# Altium project HeartSoundClone.PrjPcb
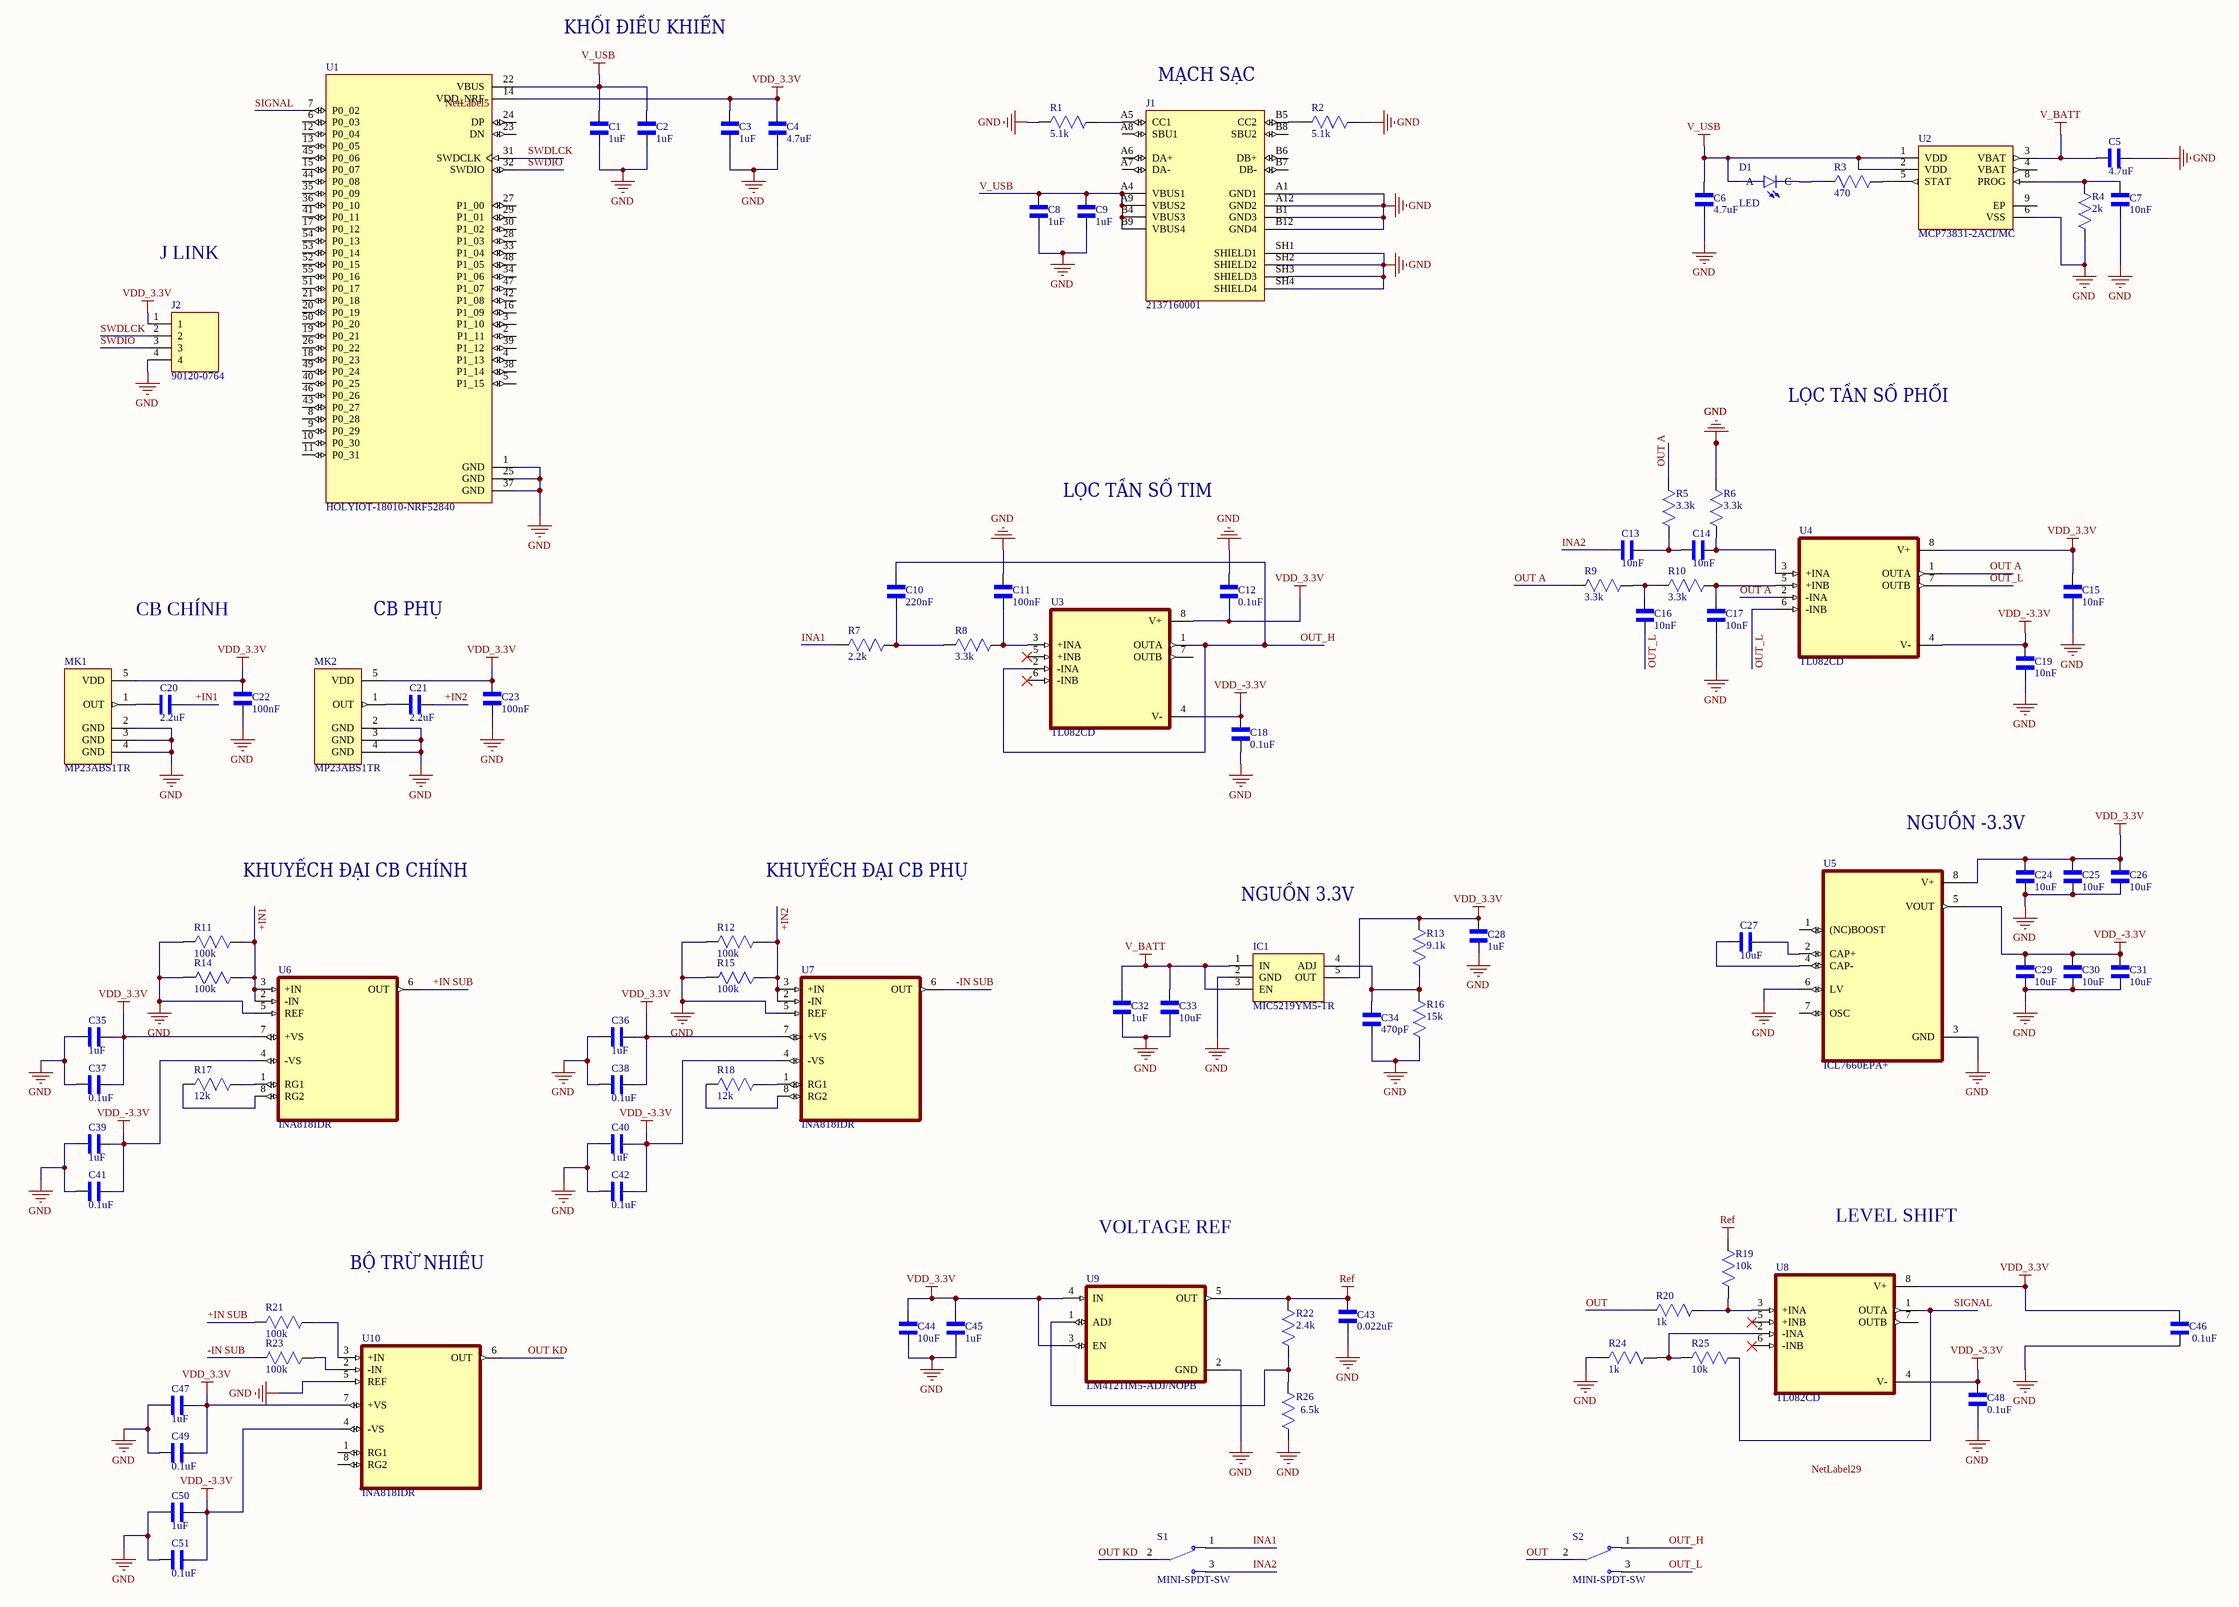
[diagram p0: Sheet2.SchDoc]
1 sheet, 95 parts. Net scope: global (net labels, ports and power ports of the same name join across sheets).
Board file: PCB1.PcbDoc

## Sheet Sheet2.SchDoc
size C; SheetNumber: 1; SheetTotal: 1

### Parts
C1  1uF  [CAPC1608X90N]
C2  1uF  [CAPC1608X90N]
C3  1uF  [CAPC1608X90N]
C4  4.7uF  [CAPC1608X90N]
C5  4.7uF  [CAPC1608X90N]
C6  4.7uF  [CAPC1608X90N]
C7  10nF  [CAPC1608X90N]
C8  1uF  [CAPC1608X90N]
C9  1uF  [CAPC1608X90N]
C10  220nF  [CAPC1608X90N]
C11  100nF  [CAPC1608X90N]
C12  0.1uF  [CAPC1608X90N]
C13  10nF  [CAPC1608X90N]
C14  10nF  [CAPC1608X90N]
C15  10nF  [CAPC1608X90N]
C16  10nF  [CAPC1608X90N]
C17  10nF  [CAPC1608X90N]
C18  0.1uF  [CAPC1608X90N]
C19  10nF  [CAPC1608X90N]
C20  2.2uF  [CAPC1608X90N]
C21  2.2uF  [CAPC1608X90N]
C22  100nF  [CAPC1608X90N]
C23  100nF  [CAPC1608X90N]
C24  10uF  [CAPC1608X90N]
C25  10uF  [CAPC1608X90N]
C26  10uF  [CAPC1608X90N]
C27  10uF  [CAPC1608X90N]
C28  1uF  [CAPC1608X90N]
C29  10uF  [CAPC1608X90N]
C30  10uF  [CAPC1608X90N]
C31  10uF  [CAPC1608X90N]
C32  1uF  [CAPC1608X90N]
C33  10uF  [CAPC1608X90N]
C34  470pF  [CAPC1608X90N]
C35  1uF  [CAPC1608X90N]
C36  1uF  [CAPC1608X90N]
C37  0.1uF  [CAPC1608X90N]
C38  0.1uF  [CAPC1608X90N]
C39  1uF  [CAPC1608X90N]
C40  1uF  [CAPC1608X90N]
C41  0.1uF  [CAPC1608X90N]
C42  0.1uF  [CAPC1608X90N]
C43  0.022uF  [CAPC1608X90N]
C44  10uF  [CAPC1608X90N]
C45  1uF  [CAPC1608X90N]
C46  0.1uF  [CAPC1608X90N]
C47  1uF  [CAPC1608X90N]
C48  0.1uF  [CAPC1608X90N]
C49  0.1uF  [CAPC1608X90N]
C50  1uF  [CAPC1608X90N]
C51  0.1uF  [CAPC1608X90N]
D1  LED  [LEDC2012X70N]
IC1  MIC5219YM5-TR  [SOT95P280X145-5N]
J1  2137160001  [MOLEX_2137160001]
J2  90120-0764  [HDRV4W90P0X254_1X4_994X249X560P]
MK1  MP23ABS1TR  [MIC_MP23ABS1TR]
MK2  MP23ABS1TR  [MIC_MP23ABS1TR]
R1  5.1k  [RESC1608X60N]
R2  5.1k  [RESC1608X60N]
R3  470  [RESC1608X60N]
R4  2k  [RESC1608X60N]
R5  3.3k  [RESC1608X60N]
R6  3.3k  [RESC1608X60N]
R7  2.2k  [RESC1608X60N]
R8  3.3k  [RESC1608X60N]
R9  3.3k  [RESC1608X60N]
R10  3.3k  [RESC1608X60N]
R11  100k  [RESC1608X60N]
R12  100k  [RESC1608X60N]
R13  9.1k  [RESC1608X60N]
R14  100k  [RESC1608X60N]
R15  100k  [RESC1608X60N]
R16  15k  [RESC1608X60N]
R17  12k  [RESC1608X60N]
R18  12k  [RESC1608X60N]
R19  10k  [RESC1608X60N]
R20  1k  [RESC1608X60N]
R21  100k  [RESC1608X60N]
R22  2.4k  [RESC1608X60N]
R23  100k  [RESC1608X60N]
R24  1k  [RESC1608X60N]
R25  10k  [RESC1608X60N]
R26  6.5k  [RESC1608X60N]
S1  MINI-SPDT-SW  [SW_MINI-SPDT-SW]
S2  MINI-SPDT-SW  [SW_MINI-SPDT-SW]
U1  HOLYIOT-18010-NRF52840  [XCVR_HOLYIOT-18010-NRF52840]
U2  MCP73831-2ACI/MC  [SON50P200X300X100-9N]
U3  TL082CD  [SOIC127P599X175-8N]
U4  TL082CD  [SOIC127P599X175-8N]
U5  ICL7660EPA+  [DIP794W47P254L991H457Q8]
U6  INA818IDR  [SOIC127P599X175-8N]
U7  INA818IDR  [SOIC127P599X175-8N]
U8  TL082CD  [SOIC127P599X175-8N]
U9  LM4121IM5-ADJ/NOPB  [SOT95P280X145-5N]
U10  INA818IDR  [SOIC127P599X175-8N]

### Nets
GND: C1.1 C2.1 C3.1 C4.1 C5.2 C6.1 C7.1 C8.1 C9.1 C11.1 C12.1 C15.1 C17.2 C18.2 C19.1 C22.1 C23.1 C24.1 C25.1 C26.1 C28.2 C29.1 C30.1 C31.1 C32.2 C33.2 C34.2 C35.2 C36.2 C37.2 C38.2 C39.2 C40.2 C41.2 C42.2 C43.2 C44.2 C45.2 C46.1 C47.2 C48.1 C49.2 C50.2 C51.2 IC1.2(GND) J1.A1(GND1) J1.A12(GND2) J1.B1(GND3) J1.B12(GND4) J1.SH1(SHIELD1) J1.SH2(SHIELD2) J1.SH3(SHIELD3) J1.SH4(SHIELD4) J2.4 MK1.2(GND) MK1.3(GND) MK1.4(GND) MK2.2(GND) MK2.3(GND) MK2.4(GND) R1.2(R2) R2.1(R1) R4.2(R2) R6.1(R1) R11.2(R2) R12.2(R2) R14.1(R1) R15.1(R1) R16.2(R2) R24.2(R2) R26.2(R2) U1.1(GND) U1.25(GND) U1.37(GND) U2.6(VSS) U5.3(GND) U5.6(LV) U6.5(REF) U7.5(REF) U9.2(GND) U10.5(REF)
Ref: C43.1 R19.1(R1) R22.1(R1) U9.5(OUT)
V_BATT: C5.1 C32.1 C33.1 IC1.1(IN) IC1.3(EN) U2.3(VBAT)
V_USB: C1.2 C2.2 C6.2 C8.2 C9.2 D1.A J1.A4(VBUS1) J1.A9(VBUS2) J1.B4(VBUS3) J1.B9(VBUS4) U1.22(VBUS) U2.1(VDD) U2.2(VDD)
VDD_3.3V: C3.2 C4.2 C12.2 C15.2 C22.2 C23.2 C24.2 C25.2 C26.2 C28.1 C35.1 C36.1 C37.1 C38.1 C44.1 C45.1 C46.2 C47.1 C49.1 IC1.5(OUT) J2.1 MK1.5(VDD) MK2.5(VDD) R13.1(R1) U1.14(VDD_NRF) U3.8(V+) U4.8(V+) U5.8(V+) U6.7(+VS) U7.7(+VS) U8.8(V+) U9.3(EN) U9.4(IN) U10.7(+VS)
VDD_-3.3V: C18.1 C19.2 C29.2 C30.2 C31.2 C39.1 C40.1 C41.1 C42.1 C48.2 C50.1 C51.1 U3.4(V-) U4.4(V-) U5.5(VOUT) U6.4(-VS) U7.4(-VS) U8.4(V-) U10.4(-VS)
+IN1: C20.1 R11.1(R1) R14.2(R2) U6.2(-IN) U6.3(+IN)
+IN2: C21.1 R12.1(R1) R15.2(R2) U7.2(-IN) U7.3(+IN)
+IN SUB: R21.2(R2) U6.6(OUT)
-IN SUB: R23.1(R1) U7.6(OUT)
INA1: R7.2(R2) S1.1
INA2: C13.2 S1.3
OUT: R20.2(R2) S2.2
OUT A: R5.1(R1) R9.2(R2) U4.1(OUTA) U4.2(-INA)
OUT KD: S1.2 U10.6(OUT)
OUT_H: C10.1 S2.1 U3.1(OUTA) U3.2(-INA)
OUT_L: C16.2 S2.3 U4.6(-INB) U4.7(OUTB)
SIGNAL: R25.1(R1) U1.7(P0_02) U8.1(OUTA)
SWDIO: J2.3 U1.32(SWDIO)
SWDLCK: J2.2 U1.31(SWDCLK)
NetC7_2: C7.2 R4.1(R1) U2.8(PROG)
NetC10_2: C10.2 R7.1(R1) R8.2(R2)
NetC11_2: C11.2 R8.1(R1) U3.3(+INA)
NetC13_1: C13.1 C14.2 R5.2(R2)
NetC14_1: C14.1 R6.2(R2) U4.3(+INA)
NetC16_1: C16.1 R9.1(R1) R10.2(R2)
NetC17_1: C17.1 R10.1(R1) U4.5(+INB)
NetC20_2: C20.2 MK1.1(OUT)
NetC21_2: C21.2 MK2.1(OUT)
NetC27_1: C27.1 U5.4(CAP-)
NetC27_2: C27.2 U5.2(CAP+)
NetC34_1: C34.1 IC1.4(ADJ) R13.2(R2) R16.1(R1)
NetD1_C: D1.C R3.2(R2)
NetJ1_A5: J1.A5(CC1) R1.1(R1)
NetJ1_B5: J1.B5(CC2) R2.2(R2)
NetR3_1: R3.1(R1) U2.5(STAT)
NetR17_1: R17.1(R1) U6.1(RG1)
NetR17_2: R17.2(R2) U6.8(RG2)
NetR18_1: R18.1(R1) U7.1(RG1)
NetR18_2: R18.2(R2) U7.8(RG2)
NetR19_2: R19.2(R2) R20.1(R1) U8.3(+INA)
NetR21_1: R21.1(R1) U10.3(+IN)
NetR22_2: R22.2(R2) R26.1(R1) U9.1(ADJ)
NetR23_2: R23.2(R2) U10.2(-IN)
NetR24_1: R24.1(R1) R25.2(R2) U8.2(-INA)

Not connected (* = marked no-connect by the designer): J1 A6(DA+) A7(DA-) A8(SBU1) B6(DB+) B7(DB-) B8(SBU2); U1 2(P1_11) 3(P1_10) 4(P1_13) 5(P1_15) 6(P0_03) 8(P0_28) 9(P0_29) 10(P0_30) 11(P0_31) 12(P0_04) 13(P0_05) 15(P0_07) 16(P1_09) 17(P0_12) 18(P0_23) 19(P0_21) 20(P0_19) 21(P0_18) 23(DN) 24(DP) 26(P0_22) 27(P1_00) 28(P1_03) 29(P1_01) 30(P1_02) 33(P1_04) 34(P1_06) 35(P0_09) 36(P0_10) 38(P1_14) 39(P1_12) 40(P0_25) 41(P0_11) 42(P1_08) 43(P0_27) 44(P0_08) 45(P0_06) 46(P0_26) 47(P1_07) 48(P1_05) 49(P0_24) 50(P0_20) 51(P0_17) 52(P0_15) 53(P0_14) 54(P0_13) 55(P0_16); U2 4(VBAT) 9(EP); U3 5(+INB)* 6(-INB)* 7(OUTB); U5 1((NC)BOOST) 7(OSC); U8 5(+INB)* 6(-INB)* 7(OUTB); U10 1(RG1) 8(RG2)

### Notes on the sheet
- KHỐI ĐIỀU KHIỂN
- (near J1) MẠCH SẠC
- J LINK
- LỌC TẦN SỐ PHỔI
- LỌC TẦN SỐ TIM
- CB CHÍNH
- CB PHỤ
- NGUỒN -3.3V
- KHUYẾCH ĐẠI CB CHÍNH
- KHUYẾCH ĐẠI CB PHỤ
- NGUỒN 3.3V
- LEVEL SHIFT
- BỘ TRỪ NHIỄU
- VOLTAGE REF
- Labels drawn without touching a wire or pin: NetLabel5, NetLabel29

### Library data of the parts
C1-C51 = CL10B104KB8NNNC: 0.1 ÂµF Â±10% 50V Ceramic Capacitor X7R 0603 (1608 Metric); MF: Samsung Electro-Mechanics; SnapEDA_Link: https://www.snapeda.com/parts/CL10B104KB8NNNC/Samsung/view-part/?ref=snap; Package: 1608-2 SAMSUNG; Value: *; MP: CL10B104KB8NNNC; Check_prices: https://www.snapeda.com/parts/CL10B104KB8NNNC/Samsung/view-part/?ref=eda
D1 = 597-5411-407F: SMD LED 0805 YG 7 | Dialight 597-5411-407F; SnapEDA_Link: https://www.snapeda.com/parts/597-5411-407F/Dialight/view-part/?ref=snap; Package: 0805 Dialight; Value: *; MF: Dialight; MP: 597-5411-407F; Check_prices: https://www.snapeda.com/parts/597-5411-407F/Dialight/view-part/?ref=eda
IC1 = MIC5219YM5-TR: Integrated Circuit; Manufacturer_Name: Microchip; Datasheet Link: http://www.microchip.com/mymicrochip/filehandler.aspx?ddocname=en579712; Height: 1.45mm; Manufacturer_Part_Number: MIC5219YM5-TR; Mouser Part Number: 998-MIC5219YM5TR; Mouser Price/Stock: https://www.mouser.co.uk/ProductDetail/Microchip-Technology/MIC5219YM5-TR?qs=U6T8BxXiZAWfHDmqF70%2FoQ%3D%3D; Arrow Part Number: MIC5219YM5-TR; Arrow Price/Stock: https://www.arrow.com/en/products/mic5219ym5-tr/microchip-technology?utm_currency=USD&region=nac
J1 = 2137160001: USB-C (USB TYPE-C) USB 2.0 Receptacle Connector 24 (16+8 Dummy) Position Through Hole, Right Angle; MF: Molex; SnapEDA_Link: https://www.snapeda.com/parts/2137160001/Molex/view-part/?ref=snap; Package: None; Value: *; MP: 2137160001; Check_prices: https://www.snapeda.com/parts/2137160001/Molex/view-part/?ref=eda
J2 = 90120-0764: Connector; Manufacturer_Name: Molex; Datasheet Link: https://www.molex.com/webdocs/datasheets/pdf/en-us/0901200764_PCB_HEADERS.pdf; Height: 5.6mm; Manufacturer_Part_Number: 90120-0764; Mouser Part Number: 538-90120-0764; Mouser Price/Stock: https://www.mouser.co.uk/ProductDetail/Molex/90120-0764?qs=QSnLD11VNirsMTdnHEPG3Q%3D%3D
MK1 MK2 = MP23ABS1TR: 35 Hz ~ 1.5 kHz Analog Microphone MEMS (Silicon) Omnidirectional (-38dB Â±1dB @ 94dB SPL) Solder Pads; MF: STMicroelectronics; SnapEDA_Link: https://www.snapeda.com/parts/MP23ABS1TR/STMicroelectronics/view-part/?ref=snap; Package: None; Value: *; MP: MP23ABS1TR; Check_prices: https://www.snapeda.com/parts/MP23ABS1TR/STMicroelectronics/view-part/?ref=eda
R1-R26 = RC0603FR-0751RL: 51 Ohms Â±1% 0.1W, 1/10W Chip Resistor 0603 (1608 Metric) Moisture Resistant Thick Film; MF: Yageo Corporation; MP: RC0603FR0751RL; SnapEDA_Link: https://www.snapeda.com/parts/RC0603FR0751RL/Yageo/view-part/?ref=snap; Package: 0603-2 YAGEO; Value: *; Check_prices: https://www.snapeda.com/parts/RC0603FR0751RL/Yageo/view-part/?ref=eda
S1 S2 = MINI-SPDT-SW: Simple breadboard friendly SPDT slide switch. Rated at 30V/200mA with operating force of 250 +/-100gf.; Availability: Unavailable; Package: None; MP: MINI-SPDT-SW; Value: *; Price: None
U1 = HOLYIOT-18010-NRF52840: Holyiot 18010 Nordic nRF52840 module Bluetooth low energy module; SnapEDA_Link: https://www.snapeda.com/parts/HOLYIOT-18010-NRF52840/Holyiot/view-part/?ref=snap; Package: Package; Value: *; MF: Holyiot; MP: HOLYIOT-18010-NRF52840; Check_prices: https://www.snapeda.com/parts/HOLYIOT-18010-NRF52840/Holyiot/view-part/?ref=eda
U2 = MCP73831-2ACI/MC: Charge Controller Li-Ion/Li-Pol 15mA to 500mA 4.2V 8-Pin DFN EP | Microchip Technology Inc. MCP73831-2ACI/MC; SnapEDA_Link: https://www.snapeda.com/parts/MCP73831-2ACI/MC/Microchip/view-part/?ref=snap; Package: VFDFN-8 Microchip; Value: *; MF: Microchip; MP: MCP73831-2ACI/MC; Check_prices: https://www.snapeda.com/parts/MCP73831-2ACI/MC/Microchip/view-part/?ref=eda
U3 U4 U8 = TL082CD: Dual, 30-V, 3-MHz, 13-V/Âµs slew rate, In to V+, JFET-input op amp; MF: Texas Instruments; SnapEDA_Link: https://www.snapeda.com/parts/TL082CD/Texas+Instruments/view-part/?ref=snap; Package: SOIC-8 Texas Instruments; Value: *; MP: TL082CD; Check_prices: https://www.snapeda.com/parts/TL082CD/Texas+Instruments/view-part/?ref=eda
U5 = ICL7660EPA+: Switched-Capacitor Voltage Converters; MF: Analog Devices; Price: None; Purchase-URL: https://pricing.snapeda.com/search/part/ICL7660EPA+/?ref=eda; Package: PDIP-8 Maxim; Check_prices: https://www.snapeda.com/parts/ICL7660EPA+/Analog+Devices/view-part/?ref=eda; Availability: In Stock; MP: ICL7660EPA+; Value: *; SnapEDA_Link: https://www.snapeda.com/parts/ICL7660EPA+/Analog+Devices/view-part/?ref=snap
U6 U7 U10 = INA818IDR: Low power (350-ÂµA), precision instrumentation amp with Â±60-V overvoltage protection (gain pins 1, 8); MF: Texas Instruments; SnapEDA_Link: https://www.snapeda.com/parts/INA818IDR/Texas+Instruments/view-part/?ref=snap; Package: SOIC-8 Texas Instruments; Value: *; MP: INA818IDR; Check_prices: https://www.snapeda.com/parts/INA818IDR/Texas+Instruments/view-part/?ref=eda
U9 = LM4121IM5-ADJ/NOPB: Fixed & adjustable-voltage, 0.2% 50-ppm/Â°C drift precision series voltage reference with enable pin; MF: Texas Instruments; SnapEDA_Link: https://www.snapeda.com/parts/LM4121IM5-ADJ/NOPB/Texas+Instruments/view-part/?ref=snap; Package: SOT-23-5 Texas Instruments; Value: *; MP: LM4121IM5-ADJ/NOPB; Check_prices: https://www.snapeda.com/parts/LM4121IM5-ADJ/NOPB/Texas+Instruments/view-part/?ref=eda